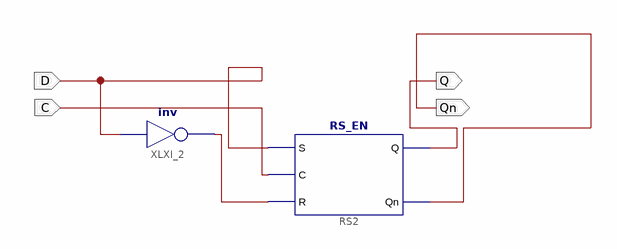
[diagram p0: schematic sheet 1]
// Xilinx ISE schematic D_EN.sch (kintex7) as structural Verilog: 2 symbols, 4 ports
module D_EN (
  input  D,
  input  C,
  output Q,
  output Qn
);

  wire XLXN_5;

  not XLXI_2 (XLXN_5, D);
  RS_EN RS2 (.S(D), .C(C), .R(XLXN_5), .Q(Q), .Qn(Qn));
endmodule
